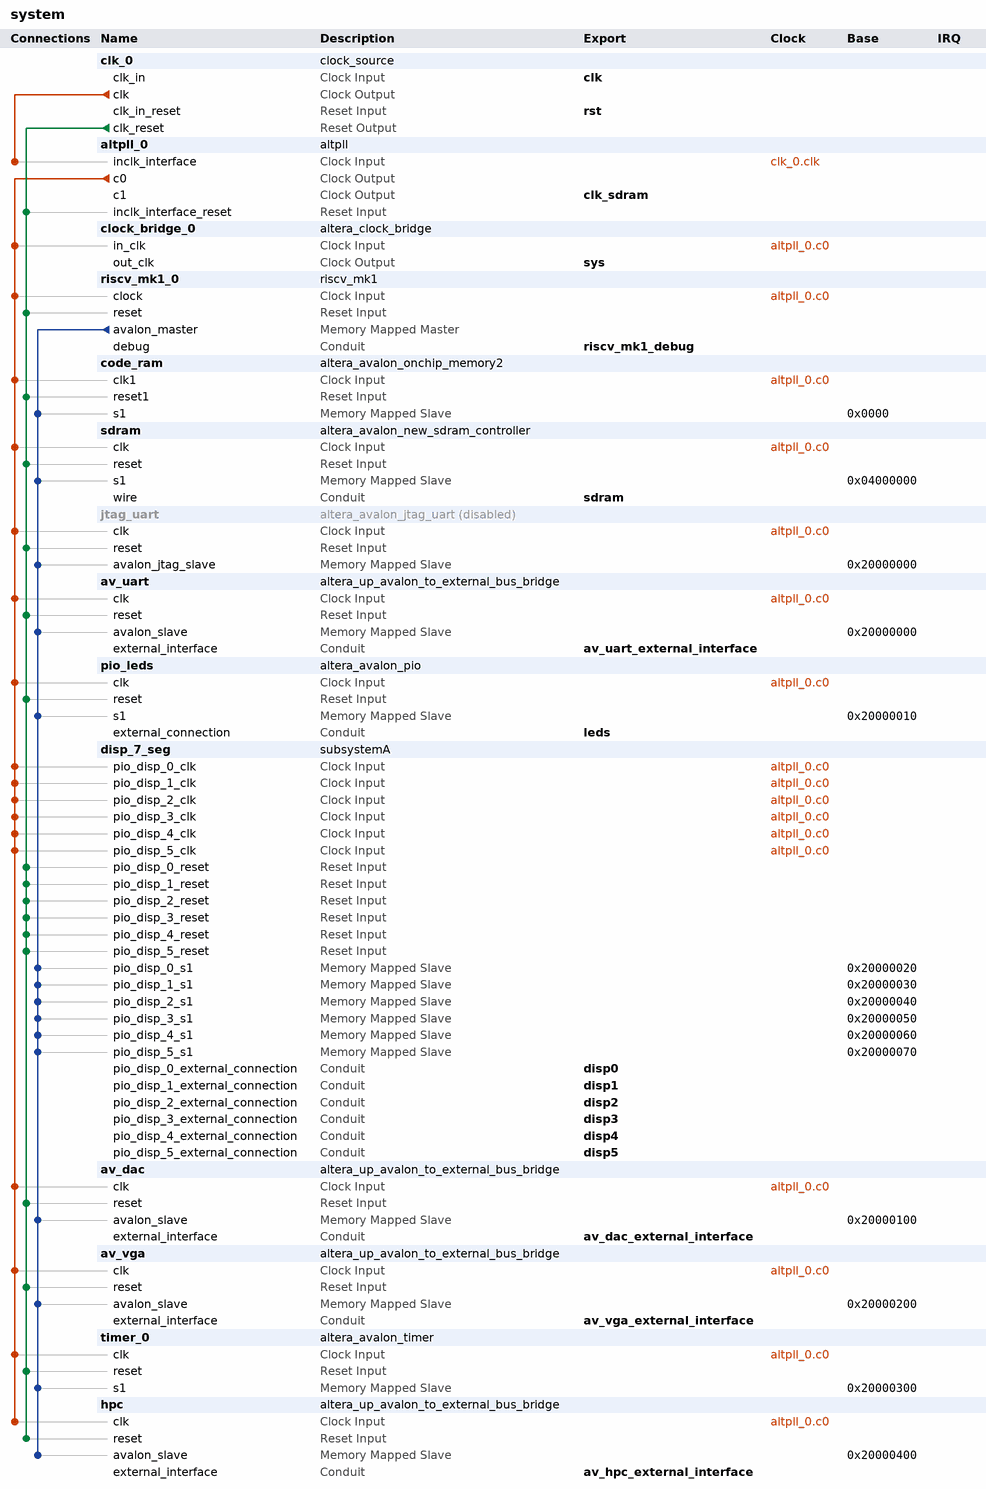
[diagram p0: system contents]
# Platform Designer (Qsys) system system, MAX 10 10M50DAF484C7G
# Parameters at their usual value, and those the tool derives, are not listed.
package require -exact qsys 18.1
create_system system
set_project_property DEVICE_FAMILY {MAX 10}
set_project_property DEVICE 10M50DAF484C7G

add_instance clk_0 clock_source 18.1
set_instance_parameter_value clk_0 clockFrequency 50000000
set_instance_parameter_value clk_0 resetSynchronousEdges DEASSERT

add_instance altpll_0 altpll 18.1
set_instance_parameter_value altpll_0 CLK0_DIVIDE_BY 1
set_instance_parameter_value altpll_0 CLK0_MULTIPLY_BY 1
set_instance_parameter_value altpll_0 CLK1_DIVIDE_BY 1
set_instance_parameter_value altpll_0 CLK1_DUTY_CYCLE 50
set_instance_parameter_value altpll_0 CLK1_MULTIPLY_BY 1
set_instance_parameter_value altpll_0 CLK1_PHASE_SHIFT -6000
set_instance_parameter_value altpll_0 INCLK0_INPUT_FREQUENCY 20000
set_instance_parameter_value altpll_0 PORT_ARESET PORT_UNUSED
set_instance_parameter_value altpll_0 PORT_LOCKED PORT_UNUSED
set_instance_parameter_value altpll_0 PORT_clk1 PORT_USED
set_instance_parameter_value altpll_0 PORT_clk2 PORT_UNUSED
set_instance_parameter_value altpll_0 PORT_clk3 PORT_UNUSED

add_instance clock_bridge_0 altera_clock_bridge 18.1
set_instance_parameter_value clock_bridge_0 DERIVED_CLOCK_RATE 50000000
set_instance_parameter_value clock_bridge_0 EXPLICIT_CLOCK_RATE 0

add_instance riscv_mk1_0 riscv_mk1 1.0

add_instance code_ram altera_avalon_onchip_memory2 18.1
set_instance_parameter_value code_ram dataWidth 32
set_instance_parameter_value code_ram dualPort false
set_instance_parameter_value code_ram initMemContent true
set_instance_parameter_value code_ram initializationFileName ../code/demo/bin/demo.mif
set_instance_parameter_value code_ram memorySize 160000
set_instance_parameter_value code_ram useNonDefaultInitFile true
set_instance_parameter_value code_ram writable false

add_instance sdram altera_avalon_new_sdram_controller 18.1
set_instance_parameter_value sdram TAC 5.5
set_instance_parameter_value sdram TRCD 15.0
set_instance_parameter_value sdram TRP 15.0
set_instance_parameter_value sdram casLatency 3
set_instance_parameter_value sdram columnWidth 10
set_instance_parameter_value sdram dataWidth 16
set_instance_parameter_value sdram generateSimulationModel false
set_instance_parameter_value sdram model single_Micron_MT48LC4M32B2_7_chip
set_instance_parameter_value sdram numberOfBanks 4
set_instance_parameter_value sdram numberOfChipSelects 1
set_instance_parameter_value sdram powerUpDelay 100.0
set_instance_parameter_value sdram refreshPeriod 7.8125
set_instance_parameter_value sdram rowWidth 13

add_instance jtag_uart altera_avalon_jtag_uart 18.1
set_instance_property jtag_uart ENABLED false
set_instance_parameter_value jtag_uart readBufferDepth 1024
set_instance_parameter_value jtag_uart simInteractiveOptions NO_INTERACTIVE_WINDOWS

add_instance av_uart altera_up_avalon_to_external_bus_bridge 18.0
set_instance_parameter_value av_uart addr_size 8
set_instance_parameter_value av_uart addr_size_multiplier bytes
set_instance_parameter_value av_uart data_size 32

add_instance pio_leds altera_avalon_pio 18.1
set_instance_parameter_value pio_leds direction Output
set_instance_parameter_value pio_leds resetValue 273
set_instance_parameter_value pio_leds width 10

add_instance disp_7_seg subsystemA 1.0

add_instance av_dac altera_up_avalon_to_external_bus_bridge 18.0
set_instance_parameter_value av_dac addr_size 8
set_instance_parameter_value av_dac addr_size_multiplier bytes
set_instance_parameter_value av_dac data_size 32

add_instance av_vga altera_up_avalon_to_external_bus_bridge 18.0
set_instance_parameter_value av_vga addr_size 16
set_instance_parameter_value av_vga addr_size_multiplier bytes
set_instance_parameter_value av_vga data_size 32

add_instance timer_0 altera_avalon_timer 18.1
set_instance_parameter_value timer_0 period 0xffffffff
set_instance_parameter_value timer_0 periodUnits CLOCKS

add_instance hpc altera_up_avalon_to_external_bus_bridge 18.0
set_instance_parameter_value hpc addr_size 64
set_instance_parameter_value hpc addr_size_multiplier bytes
set_instance_parameter_value hpc data_size 32

# connections
add_connection altpll_0.c0 av_dac.clk clock
add_connection altpll_0.c0 av_uart.clk clock
add_connection altpll_0.c0 av_vga.clk clock
add_connection altpll_0.c0 clock_bridge_0.in_clk clock
add_connection altpll_0.c0 code_ram.clk1 clock
add_connection altpll_0.c0 disp_7_seg.pio_disp_0_clk clock
add_connection altpll_0.c0 disp_7_seg.pio_disp_1_clk clock
add_connection altpll_0.c0 disp_7_seg.pio_disp_2_clk clock
add_connection altpll_0.c0 disp_7_seg.pio_disp_3_clk clock
add_connection altpll_0.c0 disp_7_seg.pio_disp_4_clk clock
add_connection altpll_0.c0 disp_7_seg.pio_disp_5_clk clock
add_connection altpll_0.c0 hpc.clk clock
add_connection altpll_0.c0 jtag_uart.clk clock
add_connection altpll_0.c0 pio_leds.clk clock
add_connection altpll_0.c0 riscv_mk1_0.clock clock
add_connection altpll_0.c0 sdram.clk clock
add_connection altpll_0.c0 timer_0.clk clock
add_connection clk_0.clk altpll_0.inclk_interface clock
add_connection clk_0.clk_reset altpll_0.inclk_interface_reset reset
add_connection clk_0.clk_reset av_dac.reset reset
add_connection clk_0.clk_reset av_uart.reset reset
add_connection clk_0.clk_reset av_vga.reset reset
add_connection clk_0.clk_reset code_ram.reset1 reset
add_connection clk_0.clk_reset disp_7_seg.pio_disp_0_reset reset
add_connection clk_0.clk_reset disp_7_seg.pio_disp_1_reset reset
add_connection clk_0.clk_reset disp_7_seg.pio_disp_2_reset reset
add_connection clk_0.clk_reset disp_7_seg.pio_disp_3_reset reset
add_connection clk_0.clk_reset disp_7_seg.pio_disp_4_reset reset
add_connection clk_0.clk_reset disp_7_seg.pio_disp_5_reset reset
add_connection clk_0.clk_reset hpc.reset reset
add_connection clk_0.clk_reset jtag_uart.reset reset
add_connection clk_0.clk_reset pio_leds.reset reset
add_connection clk_0.clk_reset riscv_mk1_0.reset reset
add_connection clk_0.clk_reset sdram.reset reset
add_connection clk_0.clk_reset timer_0.reset reset
add_connection riscv_mk1_0.avalon_master av_dac.avalon_slave avalon
set_connection_parameter_value riscv_mk1_0.avalon_master/av_dac.avalon_slave baseAddress 0x20000100
add_connection riscv_mk1_0.avalon_master av_uart.avalon_slave avalon
set_connection_parameter_value riscv_mk1_0.avalon_master/av_uart.avalon_slave baseAddress 0x20000000
add_connection riscv_mk1_0.avalon_master av_vga.avalon_slave avalon
set_connection_parameter_value riscv_mk1_0.avalon_master/av_vga.avalon_slave baseAddress 0x20000200
add_connection riscv_mk1_0.avalon_master code_ram.s1 avalon
set_connection_parameter_value riscv_mk1_0.avalon_master/code_ram.s1 baseAddress 0x0000
add_connection riscv_mk1_0.avalon_master disp_7_seg.pio_disp_0_s1 avalon
set_connection_parameter_value riscv_mk1_0.avalon_master/disp_7_seg.pio_disp_0_s1 baseAddress 0x20000020
add_connection riscv_mk1_0.avalon_master disp_7_seg.pio_disp_1_s1 avalon
set_connection_parameter_value riscv_mk1_0.avalon_master/disp_7_seg.pio_disp_1_s1 baseAddress 0x20000030
add_connection riscv_mk1_0.avalon_master disp_7_seg.pio_disp_2_s1 avalon
set_connection_parameter_value riscv_mk1_0.avalon_master/disp_7_seg.pio_disp_2_s1 baseAddress 0x20000040
add_connection riscv_mk1_0.avalon_master disp_7_seg.pio_disp_3_s1 avalon
set_connection_parameter_value riscv_mk1_0.avalon_master/disp_7_seg.pio_disp_3_s1 baseAddress 0x20000050
add_connection riscv_mk1_0.avalon_master disp_7_seg.pio_disp_4_s1 avalon
set_connection_parameter_value riscv_mk1_0.avalon_master/disp_7_seg.pio_disp_4_s1 baseAddress 0x20000060
add_connection riscv_mk1_0.avalon_master disp_7_seg.pio_disp_5_s1 avalon
set_connection_parameter_value riscv_mk1_0.avalon_master/disp_7_seg.pio_disp_5_s1 baseAddress 0x20000070
add_connection riscv_mk1_0.avalon_master hpc.avalon_slave avalon
set_connection_parameter_value riscv_mk1_0.avalon_master/hpc.avalon_slave baseAddress 0x20000400
add_connection riscv_mk1_0.avalon_master jtag_uart.avalon_jtag_slave avalon
set_connection_parameter_value riscv_mk1_0.avalon_master/jtag_uart.avalon_jtag_slave baseAddress 0x20000000
add_connection riscv_mk1_0.avalon_master pio_leds.s1 avalon
set_connection_parameter_value riscv_mk1_0.avalon_master/pio_leds.s1 baseAddress 0x20000010
add_connection riscv_mk1_0.avalon_master sdram.s1 avalon
set_connection_parameter_value riscv_mk1_0.avalon_master/sdram.s1 baseAddress 0x04000000
add_connection riscv_mk1_0.avalon_master timer_0.s1 avalon
set_connection_parameter_value riscv_mk1_0.avalon_master/timer_0.s1 baseAddress 0x20000300

# exported interfaces
add_interface av_dac_external_interface conduit end
set_interface_property av_dac_external_interface EXPORT_OF av_dac.external_interface
add_interface av_hpc_external_interface conduit end
set_interface_property av_hpc_external_interface EXPORT_OF hpc.external_interface
add_interface av_uart_external_interface conduit end
set_interface_property av_uart_external_interface EXPORT_OF av_uart.external_interface
add_interface av_vga_external_interface conduit end
set_interface_property av_vga_external_interface EXPORT_OF av_vga.external_interface
add_interface clk clock sink
set_interface_property clk EXPORT_OF clk_0.clk_in
add_interface clk_sdram clock source
set_interface_property clk_sdram EXPORT_OF altpll_0.c1
add_interface disp0 conduit end
set_interface_property disp0 EXPORT_OF disp_7_seg.pio_disp_0_external_connection
add_interface disp1 conduit end
set_interface_property disp1 EXPORT_OF disp_7_seg.pio_disp_1_external_connection
add_interface disp2 conduit end
set_interface_property disp2 EXPORT_OF disp_7_seg.pio_disp_2_external_connection
add_interface disp3 conduit end
set_interface_property disp3 EXPORT_OF disp_7_seg.pio_disp_3_external_connection
add_interface disp4 conduit end
set_interface_property disp4 EXPORT_OF disp_7_seg.pio_disp_4_external_connection
add_interface disp5 conduit end
set_interface_property disp5 EXPORT_OF disp_7_seg.pio_disp_5_external_connection
add_interface leds conduit end
set_interface_property leds EXPORT_OF pio_leds.external_connection
add_interface riscv_mk1_debug conduit end
set_interface_property riscv_mk1_debug EXPORT_OF riscv_mk1_0.debug
add_interface rst reset sink
set_interface_property rst EXPORT_OF clk_0.clk_in_reset
add_interface sdram conduit end
set_interface_property sdram EXPORT_OF sdram.wire
add_interface sys clock source
set_interface_property sys EXPORT_OF clock_bridge_0.out_clk

set_interconnect_requirement {$system} qsys_mm.clockCrossingAdapter HANDSHAKE
set_interconnect_requirement {$system} qsys_mm.enableEccProtection FALSE
set_interconnect_requirement {$system} qsys_mm.insertDefaultSlave FALSE
set_interconnect_requirement {$system} qsys_mm.maxAdditionalLatency 1

save_system system.qsys
